# EAGLE schematic schematic (EAGLE 7.5.0)
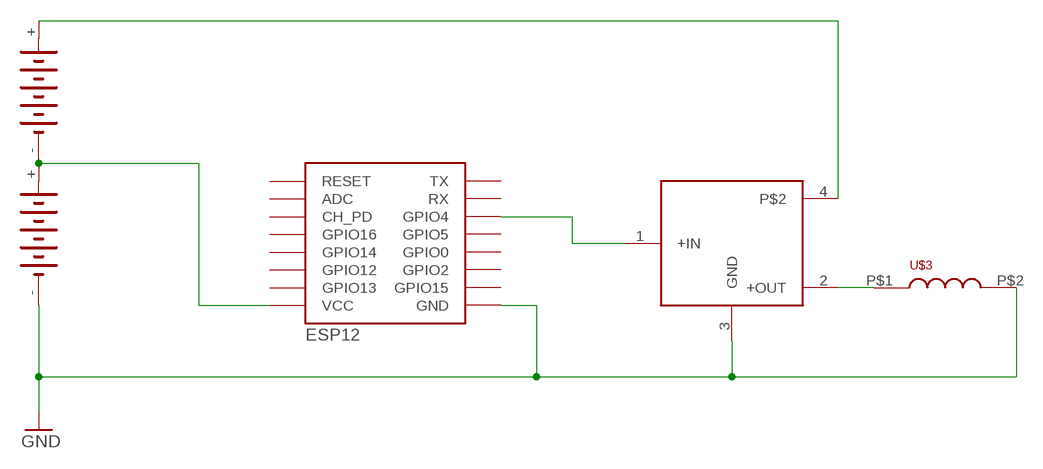
[diagram p0: schematic, sheet 1]

## Parts
G1  NC1M  [NC1M]
G2  NC1M  [NC1M]
U$1  ESP12  [ESP12]
U$2  H-BRIDGE  [H-BRIDGE]
U$3  INDUCTOR  [SCD0403T-220M-N]

## Nets
GND: G1.- U$1.GND U$2.3(GND) U$3.P$2
N$1: G1.+ G2.- U$1.VCC
N$2: G2.+ U$2.4
N$3: U$1.GPIO4 U$2.1(+IN)
N$4: U$2.2(+OUT) U$3.P$1
Unconnected: G1.+@1(+) G2.+@1(+) U$1.ADC U$1.CH_PD U$1.GPIO0 U$1.GPIO2 U$1.GPIO5 U$1.GPIO12 U$1.GPIO13 U$1.GPIO14 U$1.GPIO15 U$1.GPIO16 U$1.RESET U$1.RX U$1.TX

## Library data of the parts
G1 G2 = battery:NC1M: NC ACCU Sonnenschein Memo NC-M 6.0V, grid 17.5mm Sonnenschein
U$1 = esp8266modules:ESP12: ESP8266 Wifi module 12
U$2 = generic_h-bridge:H-BRIDGE
U$3 = jonaslib:INDUCTOR